# EAGLE design transmisorPCB_2.2 (EAGLE 7.6.0)
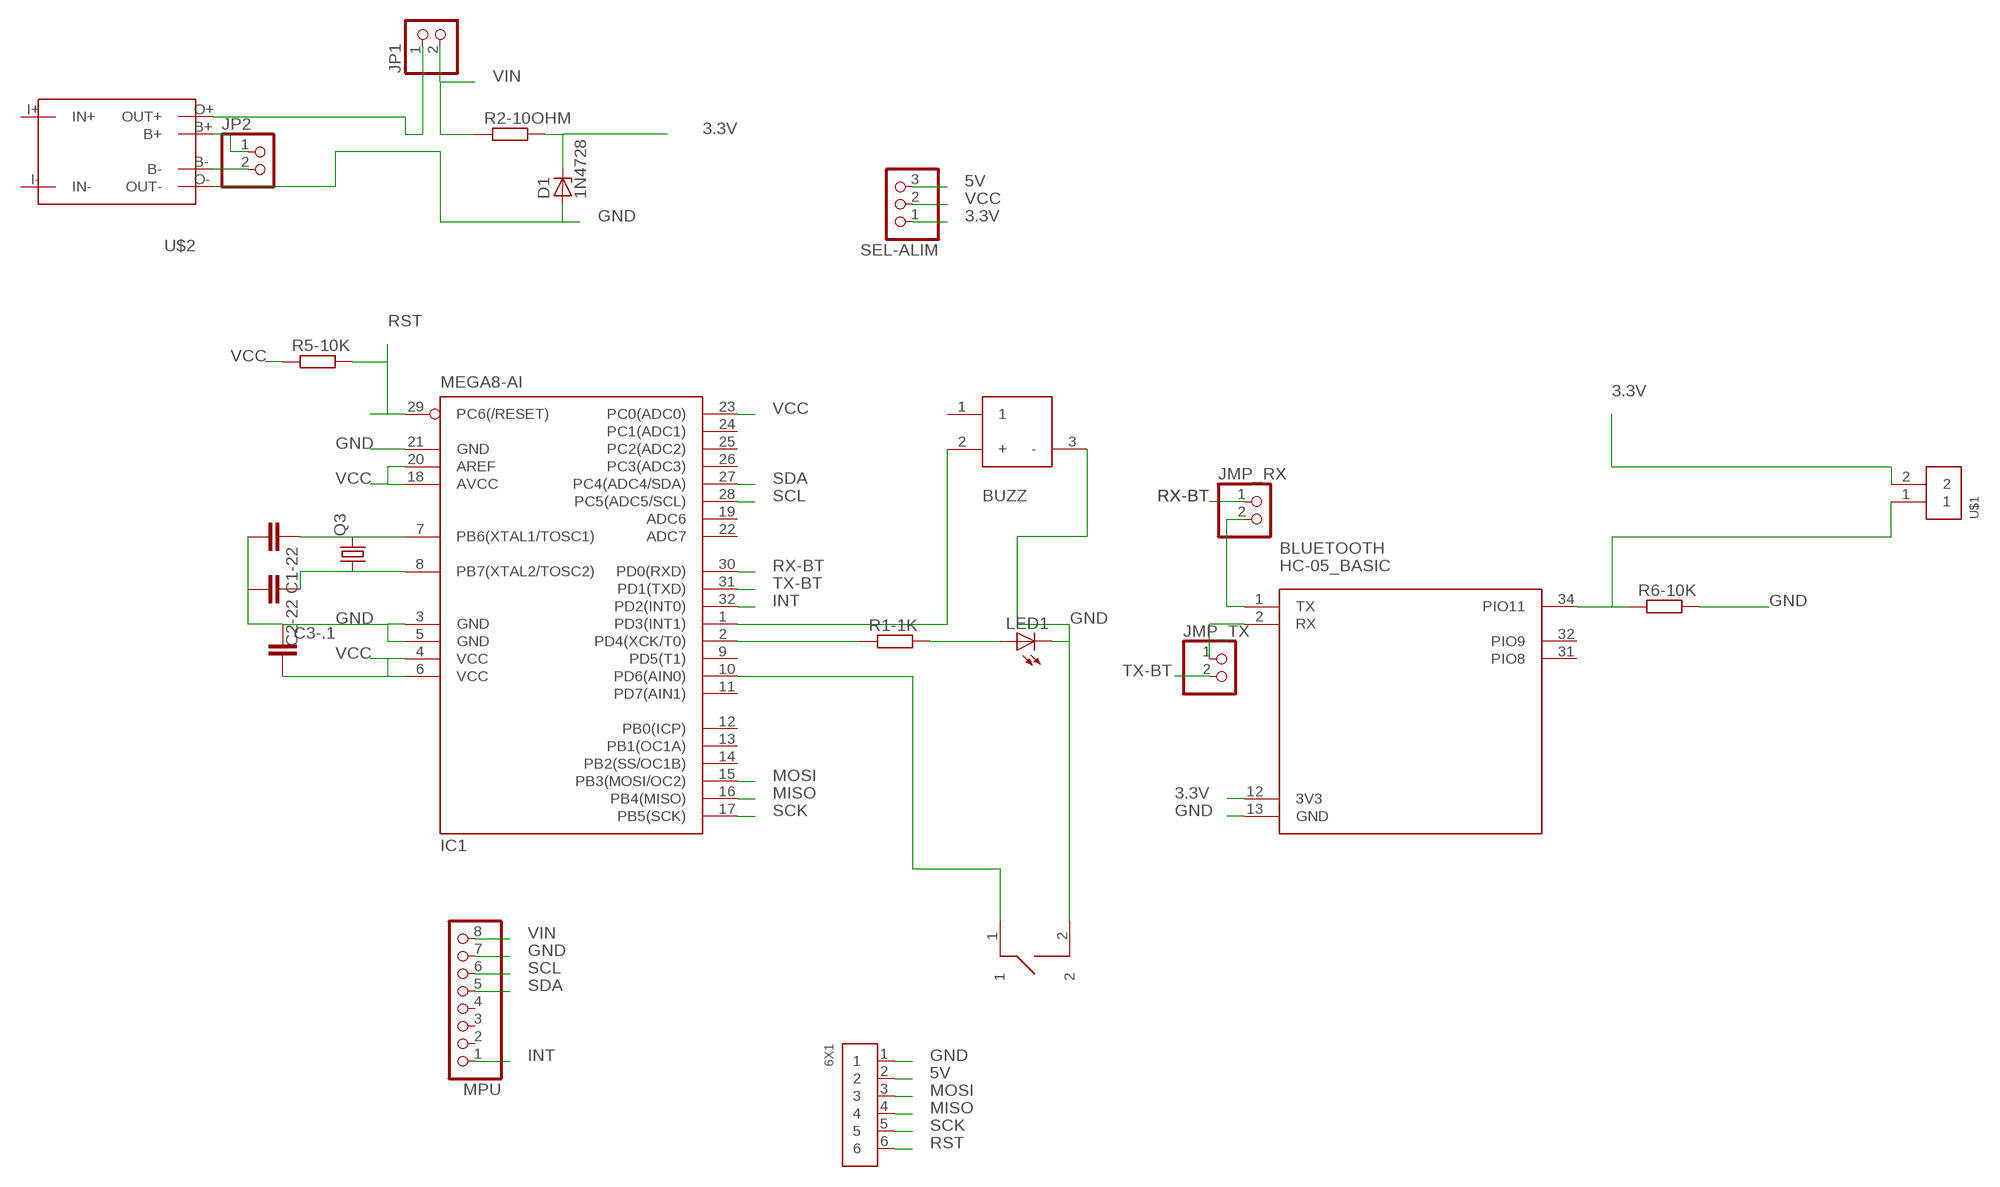
[diagram p0: schematic, sheet 1]

## Parts
6X1  PINHEAD_1X6  [PINHEAD_125_1X6]
BLUETOOTH  HC-05_BASIC  [BLUETOOTH_SMD]
BUZZ  SM05ET02A  [SM05ET02A]
C1-22  C-EUC0402K  [C0402K]
C2-22  C-EUC0402K  [C0402K]
C3-.1  C-EUC0402K  [C0402K]
D1  1N4728  [DO41Z10]
IC1  MEGA8-AI  [TQFP32-08]
JMP_RX  PINHD-1X2  [1X02]
JMP_TX  PINHD-1X2  [1X02]
JP1  PINHD-1X2  [1X02]
JP2  PINHD-1X2  [1X02]
LED1  LEDCHIPLED-0603-TTW  [CHIPLED-0603-TTW]
MPU  PINHD-1X8  [1X08]
PUSH_OFST  PUSH_SMD  [PUSH_SMD]
Q3  CRYSTALHC49U70  [HC49U70]
R1-1K  R-EU_M1206  [M1206]
R2-10OHM  R-EU_R2512  [R2512]
R5-10K  R-EU_M1206  [M1206]
R6-10K  R-EU_M1206  [M1206]
SEL-ALIM  PINHD-1X3  [1X03]
U$1  CP150_1X2  [CP150_1X2]
U$2  TP4056  [TP4056]

## Nets
3.3V: BLUETOOTH.12(3V3) D1.C R2-10OHM.2 SEL-ALIM.1 U$1.2
5V: 6X1.2 SEL-ALIM.3
GND: 6X1.1 BLUETOOTH.13(GND) BUZZ.3(-) C1-22.2 C2-22.2 C3-.1.1 D1.A IC1.3(GND) IC1.5(GND) IC1.21(GND) LED1.C@1(C) MPU.7 PUSH_OFST.2 R6-10K.2 U$2.O-(OUT-)
INT: IC1.32(PD2(INT0)) MPU.1
MISO: 6X1.4 IC1.16(PB4(MISO))
MOSI: 6X1.3 IC1.15(PB3(MOSI/OC2))
N$1: JP1.1 U$2.O+(OUT+)
N$2: BLUETOOTH.2(RX) JMP_TX.1
N$3: C1-22.1 IC1.7(PB6(XTAL1/TOSC1)) Q3.2
N$4: C2-22.1 IC1.8(PB7(XTAL2/TOSC2)) Q3.1
N$5: BUZZ.2(+) IC1.1(PD3(INT1))
N$6: IC1.2(PD4(XCK/T0)) R1-1K.1
N$7: JP2.2 U$2.B-
N$8: BLUETOOTH.1(TX) JMP_RX.2
N$9: JP2.1 U$2.B+
N$10: LED1.A@1(A) R1-1K.2
N$12: BLUETOOTH.34(PIO11) R6-10K.1 U$1.1
N$13: IC1.10(PD6(AIN0)) PUSH_OFST.1
RST: 6X1.6 IC1.29(PC6(/RESET)) R5-10K.2
RX-BT: IC1.30(PD0(RXD)) JMP_RX.1
SCK: 6X1.5 IC1.17(PB5(SCK))
SCL: IC1.28(PC5(ADC5/SCL)) MPU.6
SDA: IC1.27(PC4(ADC4/SDA)) MPU.5
TX-BT: IC1.31(PD1(TXD)) JMP_TX.2
VCC: C3-.1.2 IC1.4(VCC) IC1.6(VCC) IC1.18(AVCC) IC1.20(AREF) IC1.23(PC0(ADC0)) R5-10K.1 SEL-ALIM.2
VIN: JP1.2 MPU.8 R2-10OHM.1
Unconnected: BLUETOOTH.31(PIO8) BLUETOOTH.32(PIO9) BUZZ.1 IC1.9(PD5(T1)) IC1.11(PD7(AIN1)) IC1.12(PB0(ICP)) IC1.13(PB1(OC1A)) IC1.14(PB2(SS/OC1B)) IC1.19(ADC6) IC1.22(ADC7) IC1.24(PC1(ADC1)) IC1.25(PC2(ADC2)) IC1.26(PC3(ADC3)) MPU.2 MPU.3 MPU.4 U$2.I+(IN+) U$2.I-(IN-)

## Library data of the parts
6X1 = pinhead_125:PINHEAD_1X6
BLUETOOTH = hc05-own:HC-05_BASIC
BUZZ = buzzer2:SM05ET02A
C1-22 C2-22 C3-.1 = rcl:C-EU: CAPACITOR, European symbol
D1 = diode:1N4728: Z DIODE 3.3 V, 1W, 5 percent
IC1 = atmel:MEGA8: MICROCONTROLLER 8 Kbytes FLASH, 1 kbytes SRAM, 512 bytes EEPROM, USART, 6-channel 10 bit ADC, 2-channel 8 bit ADC Pin compatible with Atmega48, ATMega88, ATMega168 Source: avr.lbr; MPN: ATMEGA8-16AU; OC_FARNELL: 9171371; OC_NEWARK: 73M8863
JMP_RX JMP_TX JP1 JP2 = pinhead:PINHD-1X2: PIN HEADER
LED1 = led:LED: LED OSRAM: - CHIPLED LG R971, LG N971, LY N971, LG Q971, LY Q971, LO R971, LY R971 LH N974, LH R974 LS Q976, LO Q976, LY Q976 LO Q996 - Hyper CHIPLED LW Q18S LB Q993, LB Q99A, LB R99A - SideLED LS A670, LO A670, LY A670, LG A670, LP A670 LB A673, LV A673, LT A673, LW A673 LH A674 LY A675 LS A676, LA A676, LO A676, LY A676, LW A676 LS A679, LY A679, LG A679 - Hyper Micro SIDELED® LS Y876, LA Y876, LO Y876, LY Y876 LT Y87S - SmartLED LW L88C, LW L88S LB L89C, LB L89S, LG L890 LS L89K, LO L89K, LY L89K LS L896, LA L896, LO L896, LY L896 - TOPLED LS T670, LO T670, LY T670, LG T670, LP T670 LSG T670, LSP T670, LSY T670, LOP T670, LYG T670 LG T671, LOG T671, LSG T671 LB T673, LV T673, LT T673, LW T673 LH T674 LS T676, LA T676, LO T676, LY T676, LB T676, LH T676, LSB T676, LW T676 LB T67C, LV T67C, LT T67C, LS T67K, LO T67K, LY T67K, LW E67C LS E67B, LA E67B, LO E67B, LY E67B, LB E67C, LV E67C, LT E67C LW T67C LS T679, LY T679, LG T679 LS T770, LO T770, LY T770, LG T770, LP T770 LB T773, LV T773, LT T773, LW T773 LH T774 LS E675, LA E675, LY E675, LS T675 LS T776, LA T776, LO T776, LY T776, LB T776 LHGB T686 LT T68C, LB T68C - Hyper Mini TOPLED® LB M676 - Mini TOPLED Santana® LG M470 LS M47K, LO M47K, LY M47K Source: http://www.osram.convergy.de LUXEON: - LUMILED® LXK2-PW12-R00, LXK2-PW12-S00, LXK2-PW14-U00, LXK2-PW14-V00 LXK2-PM12-R00, LXK2-PM12-S00, LXK2-PM14-U00 LXK2-PE12-Q00, LXK2-PE12-R00, LXK2-PE12-S00, LXK2-PE14-T00, LXK2-PE14-U00 LXK2-PB12-K00, LXK2-PB12-L00, LXK2-PB12-M00, LXK2-PB14-N00, LXK2-PB14-P00, LXK2-PB14-Q00 LXK2-PR12-L00, LXK2-PR12-M00, LXK2-PR14-Q00, LXK2-PR14-R00 LXK2-PD12-Q00, LXK2-PD12-R00, LXK2-PD12-S00 LXK2-PH12-R00, LXK2-PH12-S00 LXK2-PL12-P00, LXK2-PL12-Q00, LXK2-PL12-R00 Source: www.luxeon.com KINGBRIGHT: KA-3528ASYC Source: www.kingbright.com
MPU = pinhead:PINHD-1X8: PIN HEADER
PUSH_OFST = push:PUSH_SMD
Q3 = crystal:CRYSTAL: CRYSTAL; OC_FARNELL: unknown; OC_NEWARK: unknown
R1-1K R5-10K R6-10K = rcl:R-EU_: RESISTOR, European symbol
R2-10OHM = resistor:R-EU_: RESISTOR, European symbol
SEL-ALIM = pinhead:PINHD-1X3: PIN HEADER
U$1 = cp150:CP150_1X2
U$2 = tp4056:TP4056

## Board
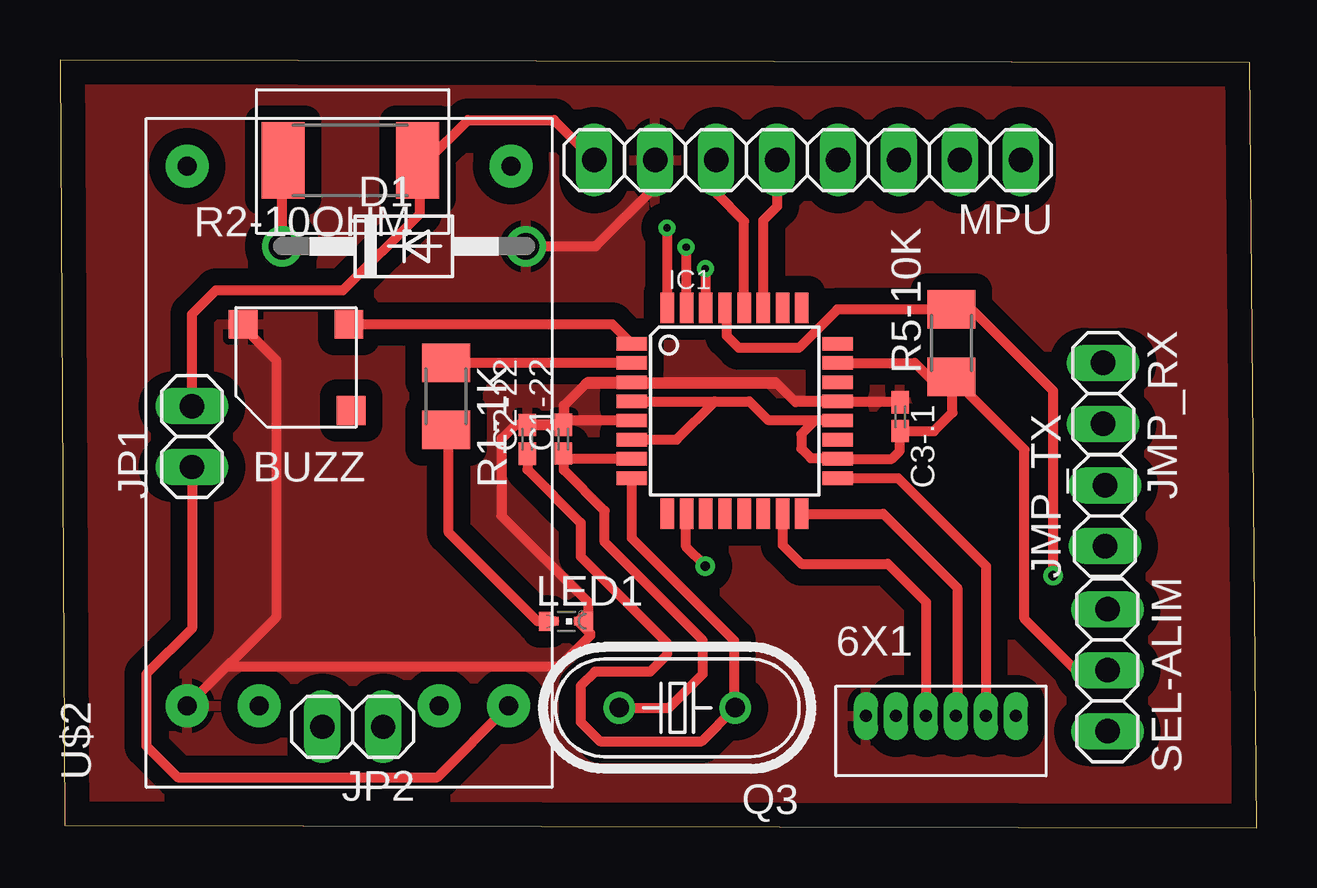
[diagram p1: board, top side]
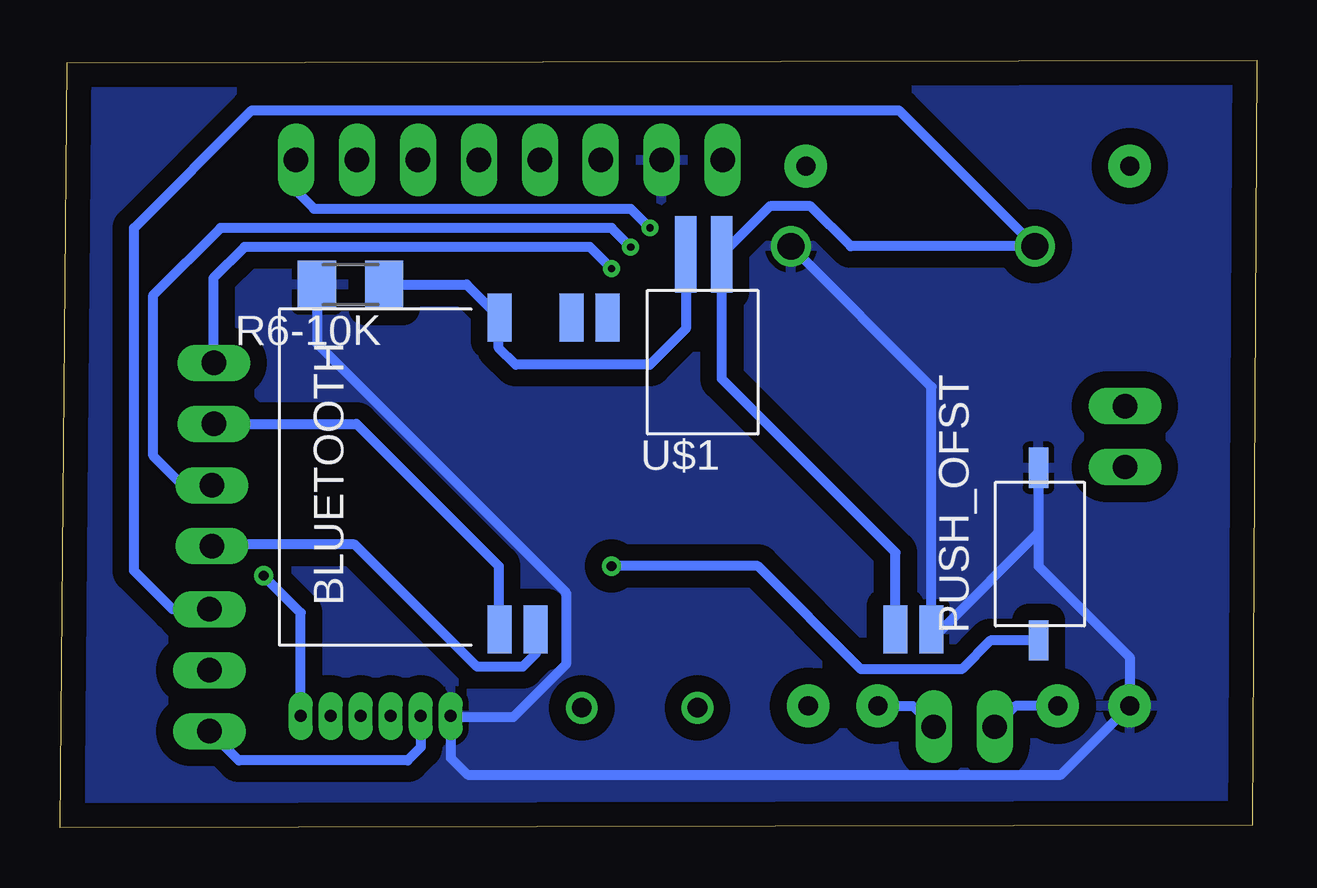
[diagram p2: board, bottom side, seen from below]

Size 49.89 x 32.01 mm. Coordinates in mm from the lower left corner, seen from the top.
Outline: 0.2,0.11 49.89,0 49.59,31.9 0,32.01 0.2,0.11
Copper layers (1*16): Top 0.035mm / dielectric 1.5mm / Bottom 0.035mm
Design rules "default": minimum track width 10mil, minimum drill 24mil, track to track 8mil, track to pad 8mil, pad to pad 8mil, via to via 8mil, smd to smd 8mil, copper to edge 40mil, drill to drill 8mil, minimum pad ring 10mil, minimum via ring 8mil, stop-mask expansion 4mil, vias tented up to drill 0mil, thermal gap 10mil

### Footprints (pad centres in the part's own frame; a part is rotated, then mirrored left to right if it is on the bottom)
PINHEAD_125_1X6 = drill 0.5 long: 1 -2.5,1.25; 2 -1.25,1.25; 3 0,1.25; 4 1.25,1.25; 5 2.5,1.25; 6 3.75,1.25
BLUETOOTH_SMD = smd 2 x 1: 1 -6.35,3.81; 2 -6.35,2.31; 12 -6.35,-12.69; 13 -6.35,-14.19; 31 6.65,-0.69; 32 6.65,0.81; 34 6.65,3.81
SM05ET02A = smd 1.2 x 1.2: 1 -2.34,1.84; 2 -2.24,-1.76; 3 2.16,-1.76
C0402K = smd 0.925 x 0.74: 1 -0.6,0; 2 0.6,0
DO41Z10 = drill 1.118: A 5.08,0; C -5.08,0
TQFP32-08 = smd 1.27 x 0.559: 1 -4.293,2.8; 2 -4.293,2; 3 -4.293,1.2; 4 -4.293,0.4; 5 -4.293,-0.4; 6 -4.293,-1.2; 7 -4.293,-2; 8 -4.293,-2.8; 17 4.293,-2.8; 18 4.293,-2; 19 4.293,-1.2; 20 4.293,-0.4; 21 4.293,0.4; 22 4.293,1.2; 23 4.293,2; 24 4.293,2.8 | smd 0.559 x 1.27: 9 -2.8,-4.293; 10 -2,-4.293; 11 -1.2,-4.293; 12 -0.4,-4.293; 13 0.4,-4.293; 14 1.2,-4.293; 15 2,-4.293; 16 2.8,-4.293; 25 2.8,4.293; 26 2,4.293; 27 1.2,4.293; 28 0.4,4.293; 29 -0.4,4.293; 30 -1.2,4.293; 31 -2,4.293; 32 -2.8,4.293
1X02 = drill 1.016 long: 1 -1.27,0; 2 1.27,0
CHIPLED-0603-TTW = smd 0.8 x 0.5: A 0,-0.875; C 0,0.875 | smd 0.35 x 0.35: A@1 0,-0.5; C@1 0,0.5
1X08 = drill 1.016 long: 1 -8.89,0; 2 -6.35,0; 3 -3.81,0; 4 -1.27,0; 5 1.27,0; 6 3.81,0; 7 6.35,0; 8 8.89,0
PUSH_SMD = smd 1.676 x 0.813: 1 -3.4,-0.1; 2 3.8,-0.1
HC49U70 = drill 0.813: 1 -2.413,0; 2 2.413,0
M1206 = smd 1.6 x 2: 1 -1.4,0; 2 1.4,0
R2512 = smd 1.8 x 3.2: 1 -2.8,0; 2 2.8,0
1X03 = drill 1.016 long: 1 -2.54,0; 2 0,0; 3 2.54,0
CP150_1X2 = smd 0.9 x 3.2: 1 -0.7,4.4; 2 0.8,4.4
TP4056 = drill 0.8 pad 1.778: B+ -10.16,-4.15; B- -10.16,3.35; I+ 12.34,-7.15; I- 12.34,6.35; O+ -10.16,-7.05; O- -10.16,6.35

### Placement (x,y rotation side)
6X1  36.1,3.41 0 top
BLUETOOTH  27.75,14.62 90 bottom
BUZZ  9.8,19.23 180 top
C1-22  20.98,16.2 90 top
C2-22  19.48,16.19 90 top
C3-.1  35.02,17.14 270 top
D1  14.34,24.24 0 top
IC1  28.12,17.38 0 top
JMP_RX  43.48,18.11 270 top
JMP_TX  43.56,13.01 90 top
JP1  5.5,16.31 90 top
JP2  12.2,4.21 180 top
LED1  21.1,8.61 270 top
MPU  31.16,27.84 180 top
PUSH_OFST  9.2,11.21 90 bottom
Q3  25.73,5 180 top
R1-1K  16.09,17.99 270 top
R2-10OHM  12.1,27.82 180 top
R5-10K  37.16,20.21 90 top
R6-10K  37.78,22.65 180 bottom
SEL-ALIM  43.66,6.57 270 top
U$1  23.1,19.51 0 bottom
U$2  11.65,15.24 90 top

### Tracks (layer width: path | path; a pad name or v marks a point on that pad's centre or on a via)
3.3V
  Top 0.406: D1.C 9.26,27.78 R2-10OHM.2
  Bottom 0.406: SEL-ALIM.1 45.2,9.11 46.8,10.71 46.8,25.01 41.9,29.91 14.93,29.91 D1.C 16.93,24.24 18.6,25.91 20.3,25.91 U$1.2 22.3,18.71 15.06,11.47 BLUETOOTH.12
5V
  Bottom 0.406: 6X1.2 34.85,3.36 35.4,2.81 42.44,2.81 SEL-ALIM.3
GND
  Top 0.406: IC1.5 21.16,16.98 C1-22.2 | 21.9,18.51 21.97,18.58 IC1.3 29.83,18.58 29.9,18.51 | 21,16.91 21,16.82 C1-22.2 | C1-22.2 C2-22.2 19.46,16.81 | 29.9,18.51 30.6,17.81 | 30.6,17.81 32.38,17.81 IC1.21 32.45,17.74 C3-.1.1 30.67,17.74 30.6,17.81 | D1.A 22.33,24.24 24.9,26.81 24.9,27.75 MPU.7 | BUZZ.3 7.64,20.87 9,19.51 9,8.78 U$2.O- 6.93,6.71 20.8,6.71 22.1,8.01 22.1,8.11 LED1.C@1 22,9.01 22,9.41 18.4,13.01 18.4,16.21 19,16.81 19.46,16.81 | 29.9,18.51 21.9,18.51 | 21.9,18.51 21,17.61 21,16.91 | 21,16.91 20.9,16.81 19.46,16.81
  Bottom 0.406: PUSH_OFST.2 9.1,12.31 | 9.1,12.31 9.1,10.91 5.3,7.11 U$2.O- 8.17,2.21 32.9,2.21 33.6,2.91 6X1.1 33.55,4.61 31,4.61 28.8,6.81 28.8,9.81 39.18,20.19 R6-10K.2 | 9.1,12.31 13.14,8.27 BLUETOOTH.13 13.56,18.38 D1.A
  pour Bottom (isolate 0.7): 0.6,31.41 48.7,31.41 49,0.51 0.8,0.71
  pour Top (isolate 0.7): 0.7,31.51 49,31.51 49,0.51 0.8,0.51
INT  (via drill 0.3)
  Top 0.406: v25.3,25.01 25.3,21.69 IC1.32
  Bottom 0.406: 25.6,25.31 v25.3,25.01 26.1,25.81 39.3,25.81 40.05,26.56 MPU.1
MISO
  Top 0.406: IC1.16 34.32,13.09 37.4,10.01 37.4,4.71 6X1.4
MOSI
  Top 0.406: IC1.15 30.12,11.79 30.9,11.01 34.5,11.01 36.1,9.41 6X1.3
N$1
  Top 0.406: JP1.1 5.5,8.31 3.6,6.41 3.6,3.41 4.9,2.11 15.73,2.11 U$2.O+
N$2
  Bottom 0.406: BLUETOOTH.2 30.06,7.25 30.6,6.71 32.5,6.71 37.6,11.81 43.49,11.81 JMP_TX.1
N$3
  Top 0.406: IC1.7 21.2,15.38 C1-22.1 21,15.58 21,14.91 22.7,13.21 22.7,11.91 26.8,7.81 26.8,6.41 25.39,5 Q3.2
N$4
  Top 0.406: IC1.8 23.83,12.08 28.1,7.81 28.1,5.04 Q3.1 26.75,3.61 22.5,3.61 21.7,4.41 21.7,5.91 22.3,6.51 24.6,6.51 25.3,7.21 25.3,7.71 21.7,11.31 21.7,12.71 19.48,14.93 C2-22.1
N$5
  Top 0.406: BUZZ.2 23.02,20.99 IC1.1
N$6
  Top 0.406: R1-1K.1 23.82,19.39 IC1.2
N$7
  Bottom 0.406: U$2.B- 10.06,5.08 JP2.2
N$8
  Bottom 0.406: JMP_RX.2 37.53,16.84 31.6,10.91 31.6,8.31 BLUETOOTH.1
N$9
  Bottom 0.406: U$2.B+ 14.34,5.08 JP2.1
N$10
  Top 0.406: LED1.A@1 19.9,8.61 16.2,12.31 16.2,16.48 R1-1K.2
N$12
  Bottom 0.406: U$1.1 23.8,20.81 25.3,19.31 30.9,19.31 31.6,20.01 31.6,21.23 BLUETOOTH.34 32.94,22.65 R6-10K.1
N$13  (via drill 0.4)
  Top 0.406: v26.9,10.91 26.1,11.71 26.1,13.07 IC1.10
  Bottom 0.406: PUSH_OFST.1 11.1,7.81 12.3,6.61 16.5,6.61 20.8,10.91 v26.9,10.91
RST  (via drill 0.4)
  Top 0.406: IC1.29 27.8,21.59 27.8,20.51 28.3,20.01 30.8,20.01 32.4,21.61 R5-10K.2 38,21.61 41.4,18.21 v41.4,10.51
  Bottom 0.406: 6X1.6 39.85,8.96 v41.4,10.51
RX-BT  (via drill 0.3)
  Top 0.406: v26.9,23.31 26.9,21.69 IC1.30
  Bottom 0.406: v26.9,23.31 27.8,24.21 42.2,24.21 43.5,22.91 43.5,19.4 JMP_RX.1
SCK
  Top 0.406: IC1.17 34.93,14.58 38.6,10.91 6X1.5
SCL
  Top 0.406: IC1.28 28.52,25.29 27.4,26.41 27.4,27.69 MPU.6
SDA
  Top 0.406: IC1.27 29.32,25.33 29.9,25.91 29.9,27.73 MPU.5
TX-BT  (via drill 0.3)
  Top 0.406: v26.1,24.21 26.1,21.69 IC1.31
  Bottom 0.406: JMP_TX.2 44.77,14.28 46,15.51 46,22.21 43.2,25.01 26.9,25.01 v26.1,24.21
VCC
  Top 0.406: R5-10K.1 37.2,18.77 37.2,17.31 36.43,16.54 C3-.1.2 35,16.52 35,15.71 34.67,15.38 IC1.18 32.38,15.41 31.3,15.41 30.9,15.81 30.9,16.41 31.47,16.98 IC1.20 32.38,17.01 29.5,17.01 28.73,17.78 27.3,17.78 | IC1.4 27.3,17.78 | IC1.6 25.7,16.18 27.3,17.78 | IC1.23 35.63,19.38 36.3,18.71 37.06,18.71 R5-10K.1 | SEL-ALIM.2 42.34,6.57 40.2,8.71 40.2,15.77 R5-10K.1
VIN
  Top 0.406: MPU.8 20.6,29.51 17,29.51 15.31,27.82 R2-10OHM.1 15,27.72 15,25.61 11.8,22.41 6.5,22.41 5.5,21.41 JP1.2